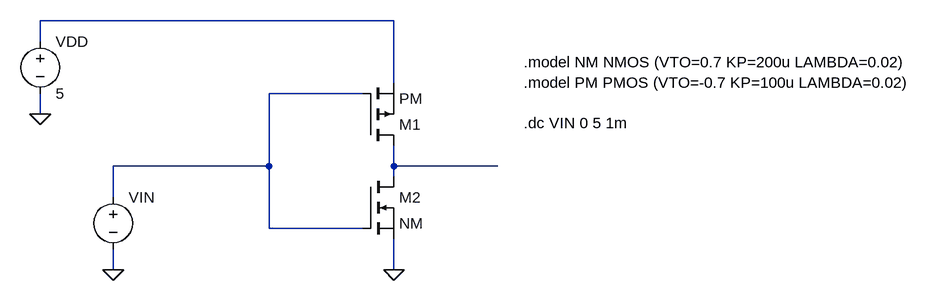
[diagram p0: schematic CMOS_INVERTER_VTC.asc]
CMOS_INVERTER_VTC.asc, the LTspice schematic file:
Version 4.1
SHEET 1 1284 680
WIRE 368 128 -176 128
WIRE -176 160 -176 128
WIRE 368 224 368 128
WIRE 320 240 176 240
WIRE -176 272 -176 240
WIRE 176 352 176 240
WIRE 176 352 -64 352
WIRE 368 352 368 320
WIRE 528 352 368 352
WIRE 368 368 368 352
WIRE -64 400 -64 352
WIRE 176 448 176 352
WIRE 320 448 176 448
WIRE -64 512 -64 480
WIRE 368 512 368 464
FLAG 368 512 0
FLAG -176 272 0
FLAG -64 512 0
SYMBOL pmos 320 320 M180
SYMATTR InstName M1
SYMATTR Value PM
SYMBOL nmos 320 368 R0
SYMATTR InstName M2
SYMATTR Value NM
SYMBOL voltage -176 144 R0
WINDOW 123 0 0 Left 0
WINDOW 39 0 0 Left 0
SYMATTR InstName VDD
SYMATTR Value 5
SYMBOL voltage -64 384 R0
WINDOW 123 0 0 Left 0
WINDOW 39 0 0 Left 0
SYMATTR InstName VIN
SYMATTR Value ""
TEXT 568 192 Left 2 !.model NM NMOS (VTO=0.7 KP=200u LAMBDA=0.02)\n.model PM PMOS (VTO=-0.7 KP=100u LAMBDA=0.02)\n \n.dc VIN 0 5 1m

The netlist it stands for:
* CMOS_INVERTER_VTC.asc
M1 N003 N002 N001 N001 PM
M2 N003 N002 0 0 NM
VDD N001 0 5
VIN N002 0
.model NMOS NMOS
.model PMOS PMOS
.lib standard.mos
.model NM NMOS (VTO=0.7 KP=200u LAMBDA=0.02)
.model PM PMOS (VTO=-0.7 KP=100u LAMBDA=0.02)
.dc VIN 0 5 1m
.backanno
.end